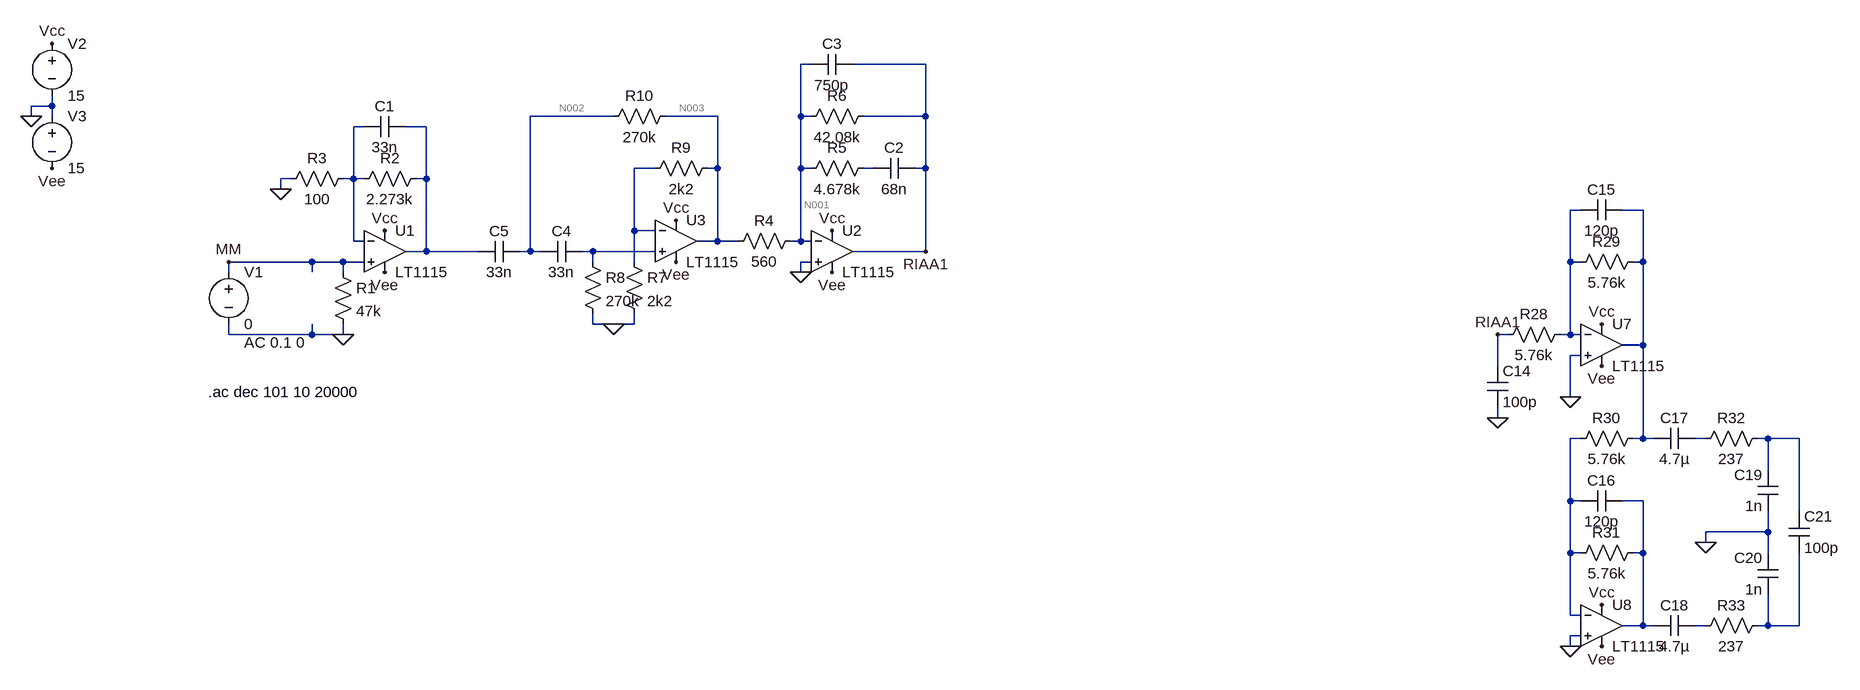
[diagram p0: schematic RIAA.asc]
RIAA.asc, the LTspice schematic file:
Version 4
SHEET 1 1940 1028
WIRE 352 -192 336 -192
WIRE 528 -192 416 -192
WIRE -816 -128 -816 -144
WIRE -816 -128 -848 -128
WIRE -848 -112 -848 -128
WIRE -816 -112 -816 -128
WIRE 48 -112 -80 -112
WIRE 208 -112 128 -112
WIRE 336 -112 336 -192
WIRE 352 -112 336 -112
WIRE 528 -112 528 -192
WIRE 528 -112 432 -112
WIRE -336 -96 -352 -96
WIRE -240 -96 -272 -96
WIRE 112 -32 80 -32
WIRE 208 -32 208 -112
WIRE 208 -32 192 -32
WIRE 336 -32 336 -112
WIRE 352 -32 336 -32
WIRE 448 -32 432 -32
WIRE 528 -32 528 -112
WIRE 528 -32 512 -32
WIRE -448 -16 -464 -16
WIRE -352 -16 -352 -96
WIRE -352 -16 -368 -16
WIRE -336 -16 -352 -16
WIRE -240 -16 -240 -96
WIRE -240 -16 -256 -16
WIRE -464 0 -464 -16
WIRE 1536 32 1520 32
WIRE 1632 32 1600 32
WIRE 80 64 80 -32
WIRE 112 64 80 64
WIRE -352 80 -352 -16
WIRE -336 80 -352 80
WIRE 208 80 208 -32
WIRE 208 80 176 80
WIRE 240 80 208 80
WIRE 336 80 336 -32
WIRE 336 80 320 80
WIRE 352 80 336 80
WIRE -240 96 -240 -16
WIRE -240 96 -272 96
WIRE -160 96 -240 96
WIRE -80 96 -80 -112
WIRE -80 96 -96 96
WIRE -64 96 -80 96
WIRE 16 96 0 96
WIRE 112 96 16 96
WIRE 528 96 528 -32
WIRE 528 96 416 96
WIRE -416 112 -544 112
WIRE -368 112 -416 112
WIRE -336 112 -368 112
WIRE 16 112 16 96
WIRE 80 112 80 64
WIRE 352 112 336 112
WIRE 1520 112 1520 32
WIRE 1536 112 1520 112
WIRE 1632 112 1632 32
WIRE 1632 112 1616 112
WIRE -544 128 -544 112
WIRE -416 128 -416 112
WIRE -368 128 -368 112
WIRE 336 128 336 112
WIRE 16 208 16 192
WIRE 48 208 16 208
WIRE 80 208 80 192
WIRE 80 208 48 208
WIRE -544 224 -544 208
WIRE -416 224 -416 208
WIRE -416 224 -544 224
WIRE -368 224 -368 208
WIRE -368 224 -416 224
WIRE 1424 224 1408 224
WIRE 1520 224 1520 112
WIRE 1520 224 1504 224
WIRE 1536 224 1520 224
WIRE 1632 240 1632 112
WIRE 1632 240 1600 240
WIRE 1536 256 1520 256
WIRE 1408 272 1408 224
WIRE 1520 320 1520 256
WIRE 1408 352 1408 336
WIRE 1536 384 1520 384
WIRE 1632 384 1632 240
WIRE 1632 384 1616 384
WIRE 1648 384 1632 384
WIRE 1728 384 1712 384
WIRE 1824 384 1808 384
WIRE 1872 384 1824 384
WIRE 1824 432 1824 384
WIRE 1520 480 1520 384
WIRE 1536 480 1520 480
WIRE 1632 480 1600 480
WIRE 1872 496 1872 384
WIRE 1824 528 1824 496
WIRE 1824 528 1728 528
WIRE 1728 544 1728 528
WIRE 1520 560 1520 480
WIRE 1536 560 1520 560
WIRE 1632 560 1632 480
WIRE 1632 560 1616 560
WIRE 1824 560 1824 528
WIRE 1520 656 1520 560
WIRE 1536 656 1520 656
WIRE 1632 672 1632 560
WIRE 1632 672 1600 672
WIRE 1648 672 1632 672
WIRE 1728 672 1712 672
WIRE 1824 672 1824 624
WIRE 1824 672 1808 672
WIRE 1872 672 1872 560
WIRE 1872 672 1824 672
WIRE 1536 688 1520 688
WIRE 1520 704 1520 688
FLAG -304 64 Vcc
FLAG 384 64 Vcc
FLAG -304 128 Vee
FLAG 384 128 Vee
FLAG -368 224 0
FLAG -464 0 0
FLAG -848 -112 0
FLAG -816 -224 Vcc
FLAG -816 -32 Vee
FLAG 336 128 0
FLAG -544 112 MM
FLAG 1520 320 0
FLAG 1408 352 0
FLAG 1568 208 Vcc
FLAG 1568 272 Vee
FLAG 1568 640 Vcc
FLAG 1568 704 Vee
FLAG 1728 544 0
FLAG 1520 704 0
FLAG 528 96 RIAA1
FLAG 1408 224 RIAA1
FLAG 144 112 Vee
FLAG 144 48 Vcc
FLAG 48 208 0
SYMBOL Opamps\\LT1115 -304 32 R0
SYMATTR InstName U1
SYMBOL res -240 -32 R90
WINDOW 0 0 56 VBottom 2
WINDOW 3 32 56 VTop 2
SYMATTR InstName R2
SYMATTR Value 2.273k
SYMBOL res -352 -32 R90
WINDOW 0 0 56 VBottom 2
WINDOW 3 32 56 VTop 2
SYMATTR InstName R3
SYMATTR Value 100
SYMBOL cap -272 -112 R90
WINDOW 0 0 32 VBottom 2
WINDOW 3 32 32 VTop 2
SYMATTR InstName C1
SYMATTR Value 33n
SYMBOL res 336 64 R90
WINDOW 0 0 56 VBottom 2
WINDOW 3 32 56 VTop 2
SYMATTR InstName R4
SYMATTR Value 560
SYMBOL res 448 -48 R90
WINDOW 0 0 56 VBottom 2
WINDOW 3 32 56 VTop 2
SYMATTR InstName R5
SYMATTR Value 4.678k
SYMBOL res 448 -128 R90
WINDOW 0 0 56 VBottom 2
WINDOW 3 32 56 VTop 2
SYMATTR InstName R6
SYMATTR Value 42.08k
SYMBOL cap 512 -48 R90
WINDOW 0 0 32 VBottom 2
WINDOW 3 32 32 VTop 2
SYMATTR InstName C2
SYMATTR Value 68n
SYMBOL voltage -544 112 R0
WINDOW 123 24 124 Left 2
WINDOW 39 0 0 Left 0
SYMATTR Value2 AC 0.1 0
SYMATTR InstName V1
SYMATTR Value 0
SYMBOL voltage -816 -240 R0
WINDOW 123 0 0 Left 0
WINDOW 39 0 0 Left 0
SYMATTR InstName V2
SYMATTR Value 15
SYMBOL voltage -816 -128 R0
WINDOW 123 0 0 Left 0
WINDOW 39 0 0 Left 0
SYMATTR InstName V3
SYMATTR Value 15
SYMBOL Opamps\\LT1115 384 32 R0
SYMATTR InstName U2
SYMBOL res -384 112 R0
SYMATTR InstName R1
SYMATTR Value 47k
SYMBOL cap 416 -208 R90
WINDOW 0 0 32 VBottom 2
WINDOW 3 32 32 VTop 2
SYMATTR InstName C3
SYMATTR Value 750p
SYMBOL Opamps\\LT1115 1568 176 R0
SYMATTR InstName U7
SYMBOL Opamps\\LT1115 1568 608 R0
SYMATTR InstName U8
SYMBOL cap 1392 272 R0
SYMATTR InstName C14
SYMATTR Value 100p
SYMBOL res 1520 208 R90
WINDOW 0 0 56 VBottom 2
WINDOW 3 32 56 VTop 2
SYMATTR InstName R28
SYMATTR Value 5.76k
SYMBOL res 1632 96 R90
WINDOW 0 0 56 VBottom 2
WINDOW 3 32 56 VTop 2
SYMATTR InstName R29
SYMATTR Value 5.76k
SYMBOL cap 1600 16 R90
WINDOW 0 0 32 VBottom 2
WINDOW 3 32 32 VTop 2
SYMATTR InstName C15
SYMATTR Value 120p
SYMBOL res 1632 368 R90
WINDOW 0 0 56 VBottom 2
WINDOW 3 32 56 VTop 2
SYMATTR InstName R30
SYMATTR Value 5.76k
SYMBOL res 1632 544 R90
WINDOW 0 0 56 VBottom 2
WINDOW 3 32 56 VTop 2
SYMATTR InstName R31
SYMATTR Value 5.76k
SYMBOL cap 1600 464 R90
WINDOW 0 0 32 VBottom 2
WINDOW 3 32 32 VTop 2
SYMATTR InstName C16
SYMATTR Value 120p
SYMBOL cap 1712 368 R90
WINDOW 0 0 32 VBottom 2
WINDOW 3 32 32 VTop 2
SYMATTR InstName C17
SYMATTR Value 4.7µ
SYMBOL cap 1712 656 R90
WINDOW 0 0 32 VBottom 2
WINDOW 3 32 32 VTop 2
SYMATTR InstName C18
SYMATTR Value 4.7µ
SYMBOL res 1824 368 R90
WINDOW 0 0 56 VBottom 2
WINDOW 3 32 56 VTop 2
SYMATTR InstName R32
SYMATTR Value 237
SYMBOL res 1824 656 R90
WINDOW 0 0 56 VBottom 2
WINDOW 3 32 56 VTop 2
SYMATTR InstName R33
SYMATTR Value 237
SYMBOL cap 1840 496 R180
WINDOW 0 24 56 Left 2
WINDOW 3 24 8 Left 2
SYMATTR InstName C19
SYMATTR Value 1n
SYMBOL cap 1840 624 R180
WINDOW 0 24 56 Left 2
WINDOW 3 24 8 Left 2
SYMATTR InstName C20
SYMATTR Value 1n
SYMBOL cap 1856 496 R0
SYMATTR InstName C21
SYMATTR Value 100p
SYMBOL Opamps\\LT1115 144 16 R0
SYMATTR InstName U3
SYMBOL res 64 96 R0
SYMATTR InstName R7
SYMATTR Value 2k2
SYMBOL res 0 96 R0
SYMATTR InstName R8
SYMATTR Value 270k
SYMBOL res 208 -48 R90
WINDOW 0 0 56 VBottom 2
WINDOW 3 32 56 VTop 2
SYMATTR InstName R9
SYMATTR Value 2k2
SYMBOL cap 0 80 R90
WINDOW 0 0 32 VBottom 2
WINDOW 3 32 32 VTop 2
SYMATTR InstName C4
SYMATTR Value 33n
SYMBOL res 144 -128 R90
WINDOW 0 0 56 VBottom 2
WINDOW 3 32 56 VTop 2
SYMATTR InstName R10
SYMATTR Value 270k
SYMBOL cap -96 80 R90
WINDOW 0 0 32 VBottom 2
WINDOW 3 32 32 VTop 2
SYMATTR InstName C5
SYMATTR Value 33n
TEXT -576 312 Left 2 !.ac dec 101 10 20000

The netlist it stands for:
* RIAA.asc
XU1 MM N004 Vcc Vee N005 LT1028  ; LT1115, pins In+ In- V+ V- OUT
R2 N005 N004 2.273k
R3 N004 0 100
C1 N005 N004 33n
R4 N001 N003 560
R5 N007 N001 4.678k
R6 RIAA1 N001 42.08k
C2 RIAA1 N007 68n
V1 MM 0 0 AC 0.1 0
V2 Vcc 0 15
V3 0 Vee 15
XU2 0 N001 Vcc Vee RIAA1 LT1028  ; LT1115, pins In+ In- V+ V- OUT
R1 MM 0 47k
C3 RIAA1 N001 750p
XU7 0 N008 Vcc Vee N009 LT1028  ; LT1115, pins In+ In- V+ V- OUT
XU8 0 N011 Vcc Vee N014 LT1028  ; LT1115, pins In+ In- V+ V- OUT
C14 RIAA1 0 100p
R28 N008 RIAA1 5.76k
R29 N009 N008 5.76k
C15 N009 N008 120p
R30 N009 N011 5.76k
R31 N014 N011 5.76k
C16 N014 N011 120p
C17 N012 N009 4.7µ
C18 N015 N014 4.7µ
R32 N013 N012 237
R33 N016 N015 237
C19 0 N013 1n
C20 N016 0 1n
C21 N013 N016 100p
XU3 N010 N006 Vcc Vee N003 LT1028  ; LT1115, pins In+ In- V+ V- OUT
R7 N006 0 2k2
R8 N010 0 270k
R9 N003 N006 2k2
C4 N010 N002 33n
R10 N003 N002 270k
C5 N002 N005 33n
.ac dec 101 10 20000
.lib LTC.lib
.backanno
.end

* Results of the author's LTspice run, read from the files saved beside the schematic
* Operating Point, zero values left out:
*   V(vcc) = 15 V
*   V(vee) = -15 V
*   I(V3) = -37 mA
*   I(V2) = -37 mA
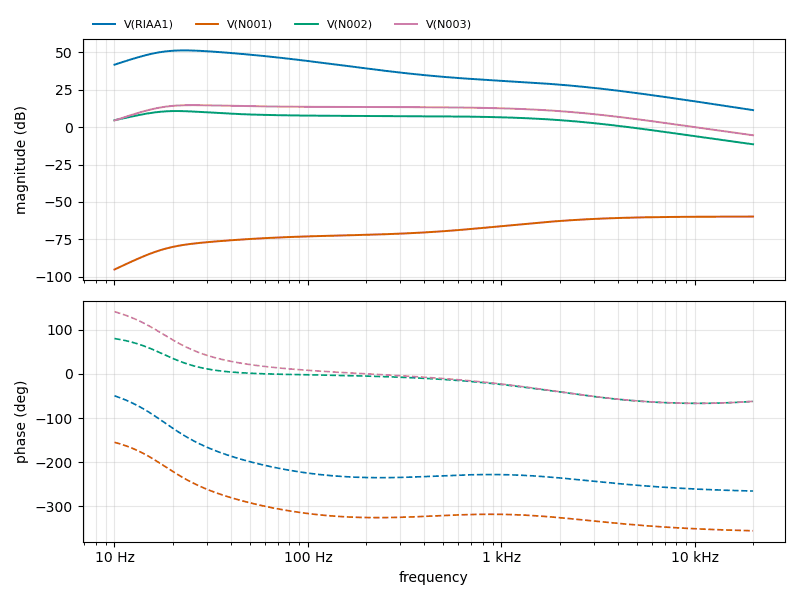
[diagram p1: AC Analysis of RIAA.asc, plotted from the saved traces]
* AC Analysis, 1 run:
*   V(RIAA1): 41.84 dB at 10 Hz, 11.44 dB at 20 kHz, peak 51.39 dB at 22.72 Hz, 3 dB below the peak at 14.72 Hz and 51.66 Hz
*   V(N001): -95.16 dB at 10 Hz, -59.76 dB at 20 kHz, peak -59.76 dB at 20 kHz, 3 dB below the peak at 1.976 kHz
*   V(N002): 4.70 dB at 10 Hz, -11.40 dB at 20 kHz, peak 10.83 dB at 20.74 Hz, 3 dB below the peak at 12.99 Hz and 91.27 Hz
*   V(N003): 4.49 dB at 10 Hz, -5.38 dB at 20 kHz, peak 14.77 dB at 25.46 Hz, 3 dB below the peak at 15.29 Hz and 1.504 kHz